# EAGLE design panner (EAGLE 9.6.2)
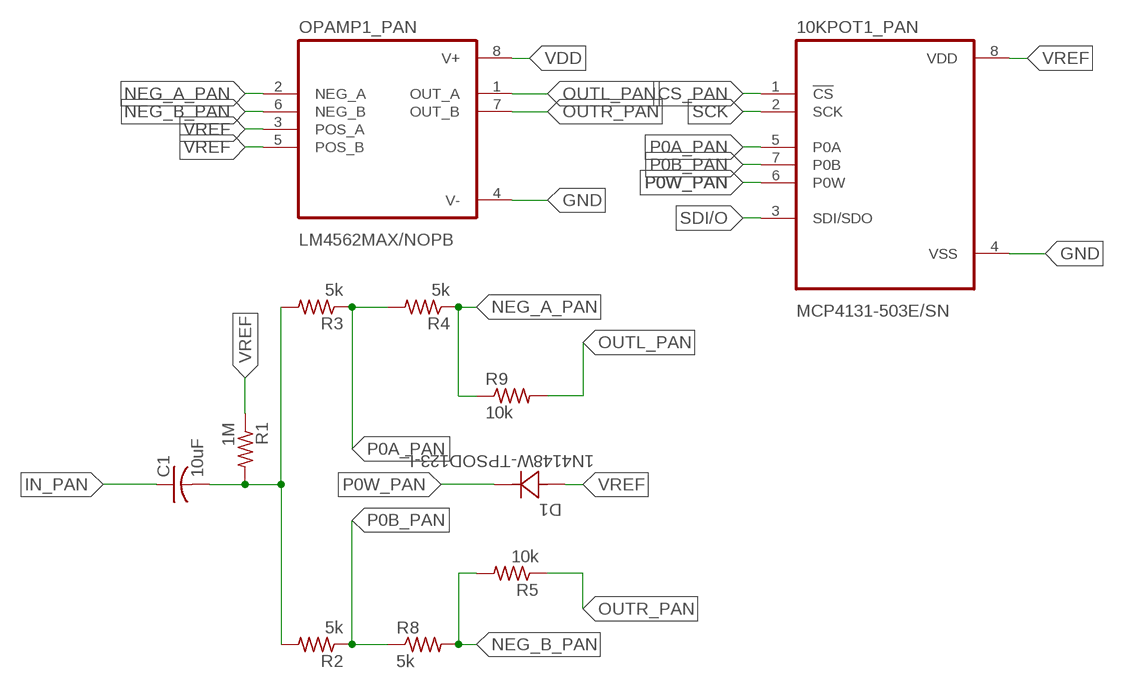
[diagram p0: schematic, sheet 1]

## Parts
10KPOT1_PAN  MCP4131-503E/SN  [SOIC127P599X175-8N]
C1  10uF  C-USC0402  [C0402]
D1  1N4148W-TPSOD123-L  [SOD123-L]
OPAMP1_PAN  LM4562MAX/NOPB  [SOIC127P599X175-8N]
R1  1M  R-US_R0402  [R0402]
R2  5k  R-US_R0402  [R0402]
R3  5k  R-US_R0402  [R0402]
R4  5k  R-US_R0402  [R0402]
R5  10k  R-US_R0402  [R0402]
R8  5k  R-US_R0402  [R0402]
R9  10k  R-US_R0402  [R0402]

## Nets
CS_PAN: 10KPOT1_PAN.1(!CS)
GND: 10KPOT1_PAN.4(VSS) OPAMP1_PAN.4(V-)
IN_PAN: C1.1
N$1: C1.2 R1.2 R2.2 R3.2
NEG_A_PAN: OPAMP1_PAN.2(NEG_A) R4.1 R9.1
NEG_B_PAN: OPAMP1_PAN.6(NEG_B) R5.2 R8.2
OUTL_PAN: OPAMP1_PAN.1(OUT_A) R9.2
OUTR_PAN: OPAMP1_PAN.7(OUT_B) R5.1
P0A_PAN: 10KPOT1_PAN.5(P0A) R3.1 R4.2
P0B_PAN: 10KPOT1_PAN.7(P0B) R2.1 R8.1
P0W_PAN: 10KPOT1_PAN.6(P0W) D1.1(C)
SCK: 10KPOT1_PAN.2(SCK)
SDI/O: 10KPOT1_PAN.3(SDI/SDO)
VDD: OPAMP1_PAN.8(V+)
VREF: 10KPOT1_PAN.8(VDD) D1.2(A) OPAMP1_PAN.3(POS_A) OPAMP1_PAN.5(POS_B) R1.1

## Library data of the parts
10KPOT1_PAN = MCP4131-503E_SN:MCP4131-503E/SN: Check availability <https://pricing.snapeda.com/parts/MCP4131-503E/SN/Microchip/view-part?ref=eda>; AVAILABILITY: In Stock; CHECK_PRICES: https://www.snapeda.com/parts/MCP4131-503E/SN/Microchip/view-part/?ref=eda; DESCRIPTION: MCP4131-503E/SN,Digi Potentiometer 50kOhm 129-Pos Linear Serial-SPI 8-Pin SOIC | Microchip Technology Inc. MCP4131-503E/SN; MF: Microchip; MP: MCP4131-503E/SN; PACKAGE: SOIC-8 Microchip; PRICE: None; PURCHASE-URL: https://www.snapeda.com/api/url_track_click_mouser/?unipart_id=129576&manufacturer=Microchip&part_name=MCP4131-503E/SN&search_term=mcp413; SNAPEDA_LINK: https://www.snapeda.com/parts/MCP4131-503E/SN/Microchip/view-part/?ref=snap; SPICEPREFIX: X
C1 = rcl:C-US: CAPACITOR, American symbol; SPICEPREFIX: C
D1 = 1N4148W-TP:1N4148W-TP: Check availability <https://pricing.snapeda.com/parts/1N4148W-TP/Micro%20Commercial/view-part?ref=eda>; AVAILABILITY: In Stock; CHECK_PRICES: https://www.snapeda.com/parts/1N4148W-TP/Micro+Commercial+Components/view-part/?ref=eda; DESCRIPTION: 1N4148W Series 100 V 150 mA 4 ns SMT High Speed Switching Diode - SOD-123; MF: Micro Commercial; MP: 1N4148W-TP; PACKAGE: SOD-123 Multicomp; PRICE: None; PURCHASE-URL: https://www.snapeda.com/api/url_track_click_mouser/?unipart_id=9224&manufacturer=Micro Commercial&part_name=1N4148W-TP&search_term=1n4148 surface mount; SNAPEDA_LINK: https://www.snapeda.com/parts/1N4148W-TP/Micro+Commercial+Components/view-part/?ref=snap
OPAMP1_PAN = LM4562MAX_NOPB:LM4562MAX/NOPB: Check availability <https://pricing.snapeda.com/parts/LM4562MAX/NOPB/Texas%20Instruments/view-part?ref=eda>; AVAILABILITY: In Stock; CHECK_PRICES: https://www.snapeda.com/parts/LM4562MAX/NOPB/Texas+Instruments/view-part/?ref=eda; DESCRIPTION: 2-channel, 55-MHz, high-fidelity, high performance audio op amp; MF: Texas Instruments; MP: LM4562MAX/NOPB; PACKAGE: SOIC-8 Texas Instruments; PRICE: None; PURCHASE-URL: https://www.snapeda.com/api/url_track_click_mouser/?unipart_id=21165&manufacturer=Texas Instruments&part_name=LM4562MAX/NOPB&search_term=lm4562; SNAPEDA_LINK: https://www.snapeda.com/parts/LM4562MAX/NOPB/Texas+Instruments/view-part/?ref=snap
R1-R5 R8 R9 = rcl:R-US_: RESISTOR, American symbol; SPICEPREFIX: R

## Board
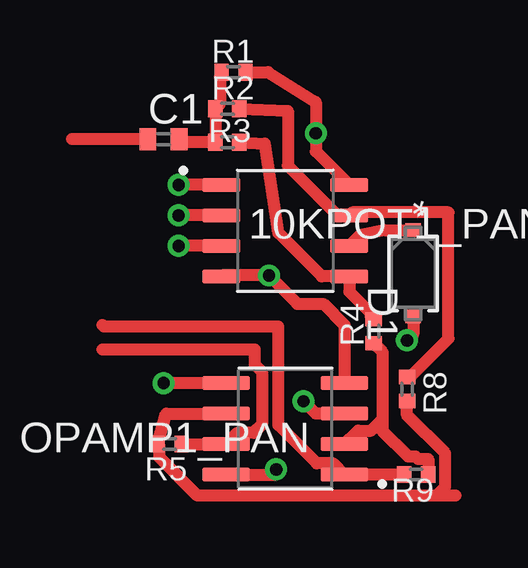
[diagram p1: board, top side]
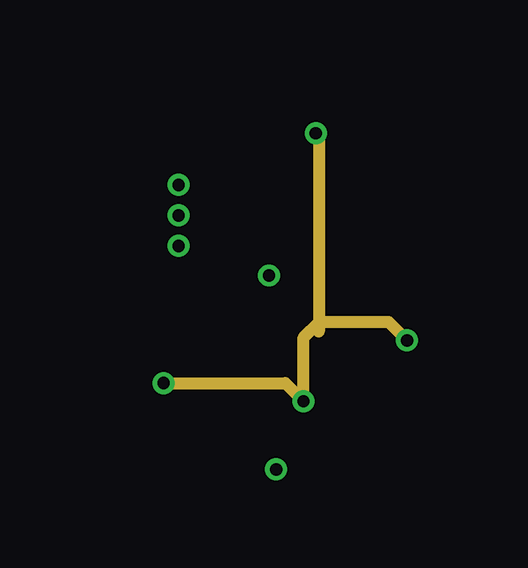
[diagram p2: board, inner layer Route15]

No outline drawn. Coordinates in mm, seen from the top.
Copper layers (1+2*15+16): Top 0.035mm / dielectric 0.2mm / Route2 0.035mm / dielectric 0.15mm / Route15 0.035mm / dielectric 0.2mm / Bottom 0.035mm
Design rules "default *": minimum track width 6mil, minimum drill 0.35mm, track to track 6mil, track to pad 6mil, pad to pad 6mil, via to via 6mil, smd to smd 6mil, copper to edge 40mil, drill to drill 6mil, minimum pad ring 10mil, minimum via ring 8mil, stop-mask expansion 4mil, vias tented up to drill 0mil, thermal gap 10mil

### Footprints (pad centres in the part's own frame; a part is rotated, then mirrored left to right if it is on the bottom)
SOIC127P599X175-8N = smd 1.58 x 0.6: 1 -2.67,1.905; 2 -2.67,0.635; 3 -2.67,-0.635; 4 -2.67,-1.905; 5 2.67,-1.905; 6 2.67,-0.635; 7 2.67,0.635; 8 2.67,1.905
C0402 = smd 0.7 x 0.9: 1 -0.65,0; 2 0.65,0
SOD123-L = smd 0.559 x 0.66: 1 -1.803,0; 2 1.803,0
SOIC127P599X175-8N' = smd 1.97 x 0.6: 1 -2.47,1.905; 2 -2.47,0.635; 3 -2.47,-0.635; 4 -2.47,-1.905; 5 2.47,-1.905; 6 2.47,-0.635; 7 2.47,0.635; 8 2.47,1.905
R0402 = smd 0.6 x 0.7: 1 -0.5,0; 2 0.5,0

### Placement (x,y rotation side)
10KPOT1_PAN  12.7,17.78 0 top
C1  7.62,21.59 0 top
D1  18.03,16 270 top
OPAMP1_PAN  LM4562MAX/NOPB  [SOIC127P599X175-8N']  12.7,9.53 180 top
R1  10.54,24.38 180 top
R2  10.29,22.86 180 top
R3  10.29,21.46 180 top
R4  16.38,13.59 90 top
R5  7.87,8.89 180 top
R8  17.78,11.18 270 top
R9  18.16,7.62 180 top

### Tracks (layer width: path | path; a pad name or v marks a point on that pad's centre or on a via)
CS_PAN  (via drill 0.51)
  Top 0.508: 10KPOT1_PAN.1 v8.26,19.68
GND  (via drill 0.51)
  Top 0.508: OPAMP1_PAN.4 15.17,13.85 14.29,14.73 13.21,14.73 12.7,15.24 v12.03,15.91 v12.02,15.91 | v12.02,15.91 11.98,15.88 | v12.02,15.91 10.07,15.91 10KPOT1_PAN.4
IN_PAN
  Top 0.508: C1.1 3.81,21.59
N$1
  Top 0.508: R1.2 10.04,24.24 9.98,24.18 9.98,23.05 R2.2 R3.2 8.4,21.46 C1.2
NEG_A_PAN
  Top 0.508: 15.42,9.14 OPAMP1_PAN.2 15.73,9.45 16.28,9.45 16.75,9.92 | R9.1 18.66,8.27 18.23,8.27 18.13,8.38 17.82,8.38 16.75,9.45 16.75,9.92 | R4.1 16.76,12.71 16.76,9.94 16.75,9.92
NEG_B_PAN
  Top 0.508: 19.81,6.74 19.05,6.74 | 19.05,6.74 9.03,6.74 7.44,8.33 7.44,8.82 R5.2 7.74,10.16 OPAMP1_PAN.6 | 19.05,6.74 19.05,6.78 19.37,7.1 19.37,8.5 17.78,10.09 R8.2
OUTL_PAN
  Top 0.508: R9.2 OPAMP1_PAN.1 14.71,8.08 14.02,8.08 12.41,9.69 12.41,13.78 5.14,13.78 5.08,13.84
OUTR_PAN
  Top 0.508: R5.1 OPAMP1_PAN.7 10.69,9.35 11.38,9.35 11.72,9.69 11.72,11.9 11.43,12.19 11.43,12.83 5.08,12.83
P0A_PAN
  Top 0.508: R3.1 11.85,21.4 12.41,17.69 14.23,15.88 10KPOT1_PAN.5 15.37,15.24 16.27,14.34 16.27,14.2 R4.2
P0B_PAN
  Top 0.508: R2.1 12.8,22.77 12.8,20.49 14.88,18.41 10KPOT1_PAN.7 15.5,18.54 19.51,18.54 19.51,13.28 17.9,11.68 R8.1
P0W_PAN
  Top 0.508: 10KPOT1_PAN.6 15.82,17.59 16.83,17.8 D1.1
SCK  (via drill 0.51)
  Top 0.508: 10KPOT1_PAN.2 v8.26,18.41
SDI/O  (via drill 0.51)
  Top 0.508: 10KPOT1_PAN.3 v8.26,17.14
VDD  (via drill 0.51)
  Top 0.508: OPAMP1_PAN.8 12.32,7.62 v12.32,7.83
VREF  (via drill 0.51)
  Top 0.508: 10KPOT1_PAN.8 13.97,21.09 v13.97,21.84 13.97,23.14 11.98,24.38 R1.1 | OPAMP1_PAN.3 13.97,10.16 v13.46,10.67 | D1.2 18.03,13.46 17.78,13.26 v17.78,13.21 | OPAMP1_PAN.5 v7.62,11.43
  Route15 0.508: v13.97,21.84 14.1,21.72 14.1,13.97 | 14.1,13.97 14.1,13.59 | 14.1,13.97 13.46,13.34 v13.46,10.67 12.7,11.43 v7.62,11.43 | v17.78,13.21 17.02,13.97 14.1,13.97